# Altium project TX_Round1.PrjPcb
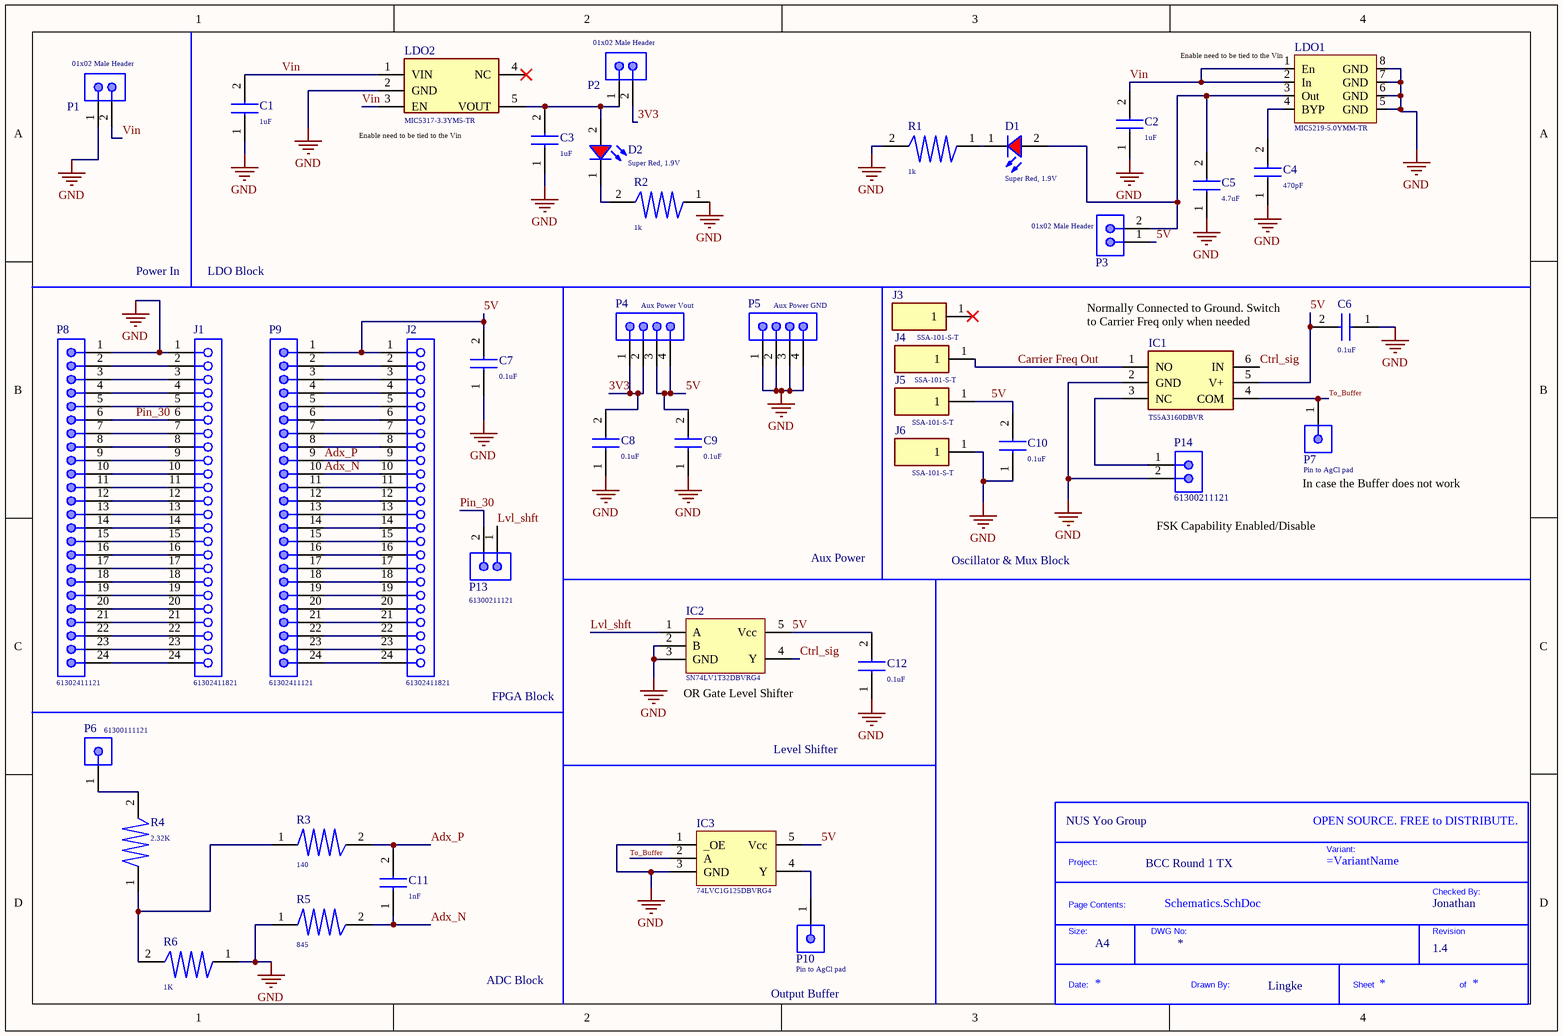
[diagram p0: Schematics.SchDoc]
1 sheet, 44 parts. Net scope: global (net labels, ports and power ports of the same name join across sheets).
Board file: Layout.PcbDoc

## Sheet Schematics.SchDoc
size A4

### Parts
*?  Project Name: BCC Round 1 TX  Company: NUS Yoo Group  Drawn By: Lingke  Revision: 1.4  Size: A4  Checked By: Jonathan  (hidden comment: Title_Block)  (no BOM)
C1  1uF  [0603]
C2  1uF  [0603]
C3  1uF  [0603]
C4  470pF  [0603]
C5  4.7uF  [0603]
C6  0.1uF  [0603]
C7  0.1uF  [0603]
C8  0.1uF  [0603]
C9  0.1uF  [0603]
C10  0.1uF  [0603]
C11  1nF  [0603]
C12  0.1uF  [0603]
D1  Super Red, 1.9V  [WL-SMCW_0603_H=0.7mm]
D2  Super Red, 1.9V  [WL-SMCW_0603_H=0.7mm]
IC1  TS5A3160DBVR  [SOT-23-6]
IC2  SN74LV1T32DBVRG4  [SOT-23-5]
IC3  74LVC1G125DBVRG4  [SOT-23-5]
J1  61302411821  [61302411821]
J2  61302411821  [61302411821]
J3  SSA-101-S-T  [SSA-101-S-X]
J4  SSA-101-S-T  [SSA-101-S-X]
J5  SSA-101-S-T  [SSA-101-S-X]
J6  SSA-101-S-T  [SSA-101-S-X]
LDO1  MIC5219-5.0YMM-TR  [MSOP-8_MS]
LDO2  MIC5317-3.3YM5-TR  [SOT-23-5]
P1  01x02 Male Header  [61300211121]
P2  01x02 Male Header  [61300211121]
P3  01x02 Male Header  [61300211121]
P4  Aux Power Vout  [61300411121]
P5  Aux Power GND  [61300411121]
P6  61300111121  [61300111121]
P7  Pin to AgCl pad  [61300111121]
P8  61302411121  [61302411121]
P9  61302411121  [61302411121]
P10  Pin to AgCl pad  [61300111121]
P13  61300211121  [61300211121]
P14  61300211121  [61300211121]
R1  1k  [0603]
R2  1k  [0603]
R3  140  [0603]
R4  2.32K  [0603]
R5  845  [0603]
R6  1K  [0603]

### Nets
GND: C1.1 C2.1 C3.1 C4.1 C5.1 C6.1 C7.1 C8.1 C9.1 C10.1 C12.1 IC1.2(GND) IC2.2(B) IC2.3(GND) IC3.1(_OE) IC3.3(GND) J1.1 J6.1 LDO1.5(GND) LDO1.6(GND) LDO1.7(GND) LDO1.8(GND) LDO2.2(GND) P1.1 P5.1 P5.2 P5.3 P5.4 P8.1 P14.2 R1.2 R2.1 R5.1 R6.1
3V3: C8.2 P2.2 P4.1 P4.2
5V: C6.2 C7.2 C9.2 C10.2 C12.2 IC1.5(V+) IC2.5(Vcc) IC3.5(Vcc) J2.1 J5.1 P3.1 P4.3 P4.4 P9.1
Adx_N: C11.1 J2.10 P9.10 R5.2
Adx_P: C11.2 J2.9 P9.9 R3.2
Carrier Freq Out: IC1.1(NO) J4.1
Ctrl_sig: IC1.6(IN) IC2.4(Y)
Lvl_shft: IC2.1(A) P13.1
Pin_30: J1.6 P8.6 P13.2
To_Buffer: IC1.4(COM) IC3.2(A) P7.1
Vin: C1.2 C2.2 LDO1.1(En) LDO1.2(In) LDO2.1(VIN) LDO2.3(EN) P1.2
NetC3_2: C3.2 D2.2(A) LDO2.5(VOUT) P2.1
NetC4_2: C4.2 LDO1.4(BYP)
NetC5_2: C5.2 D1.2(A) LDO1.3(Out) P3.2
NetD1_1: D1.1(K) R1.1
NetD2_1: D2.1(K) R2.2
NetIC1_3: IC1.3(NC) P14.1
NetIC3_4: IC3.4(Y) P10.1
NetJ1_2: J1.2 P8.2
NetJ1_3: J1.3 P8.3
NetJ1_4: J1.4 P8.4
NetJ1_5: J1.5 P8.5
NetJ1_7: J1.7 P8.7
NetJ1_8: J1.8 P8.8
NetJ1_9: J1.9 P8.9
NetJ1_10: J1.10 P8.10
NetJ1_11: J1.11 P8.11
NetJ1_12: J1.12 P8.12
NetJ1_13: J1.13 P8.13
NetJ1_14: J1.14 P8.14
NetJ1_15: J1.15 P8.15
NetJ1_16: J1.16 P8.16
NetJ1_17: J1.17 P8.17
NetJ1_18: J1.18 P8.18
NetJ1_19: J1.19 P8.19
NetJ1_20: J1.20 P8.20
NetJ1_21: J1.21 P8.21
NetJ1_22: J1.22 P8.22
NetJ1_23: J1.23 P8.23
NetJ1_24: J1.24 P8.24
NetJ2_2: J2.2 P9.2
NetJ2_3: J2.3 P9.3
NetJ2_4: J2.4 P9.4
NetJ2_5: J2.5 P9.5
NetJ2_6: J2.6 P9.6
NetJ2_7: J2.7 P9.7
NetJ2_8: J2.8 P9.8
NetJ2_11: J2.11 P9.11
NetJ2_12: J2.12 P9.12
NetJ2_13: J2.13 P9.13
NetJ2_14: J2.14 P9.14
NetJ2_15: J2.15 P9.15
NetJ2_16: J2.16 P9.16
NetJ2_17: J2.17 P9.17
NetJ2_18: J2.18 P9.18
NetJ2_19: J2.19 P9.19
NetJ2_20: J2.20 P9.20
NetJ2_21: J2.21 P9.21
NetJ2_22: J2.22 P9.22
NetJ2_23: J2.23 P9.23
NetJ2_24: J2.24 P9.24
NetP6_1: P6.1 R4.2
NetR3_1: R3.1 R4.1 R6.2

Not connected (* = marked no-connect by the designer): J3 1*; LDO2 4(NC)*

### Notes on the sheet
- (near LDO1) Enable need to be tied to the Vin
- (near LDO2) Enable need to be tied to the Vin
- Power In
- LDO Block
- Normally Connected to Ground. Switch to Carrier Freq only when needed
- (near P7) In case the Buffer does not work
- Aux Power
- Oscillator & Mux Block
- (near P14) FSK Capability Enabled/Disable
- FPGA Block
- (near IC2) OR Gate Level Shifter
- Level Shifter
- ADC Block
- Output Buffer
- (in symbol Title_Block) OPEN SOURCE. FREE to DISTRIBUTE.; Variant:; Project:; Checked By:; Page Contents:; Size:; DWG No:; Revision; Date:; Drawn By:; Sheet; of

### Library data of the parts
*? = Title_Block: Standard Title Block.; DWG No: *
C1-C12 = Capacitor
D1 D2 = 150060SS75000: WL-SMCW SMT Mono-color Chip LED Waterclear, size 0603, Super Red, 1.9V, 140deg; Chip Technology: AlInGaP; Dominant Wavelength typ.: 630nm; Luminous Intensity typ.: 60mcd; Peak Wavelength typ.: 645nm; Viewing Angle: 140deg; ComponentLink1Description: Manufacturer; ComponentLink1URL: http://www.we-online.de; ComponentLink2URL: https://www.we-online.com/catalog/datasheet/150060SS75000.pdf; ComponentLink2Description: Datasheet; Forward Voltage typ.: 1.9V; Emitting Color: Super Red; Mounting Technology: SMT; Operating Temperature: -40 to +85degC; Published Date: December 2019; Part Number: 150060SS75000; Packaging: Tape and Reel; Size: 0603; Publisher: Wurth Elektronik
IC1 = TS5A3160DBVR: Integrated Circuit; Manufacturer_Name: Texas Instruments; Datasheet Link: http://www.ti.com/lit/gpn/ts5a3160; Height: 1.45mm; Mouser2 Part Number: 595-TS5A3160DBVR; Mouser2 Price/Stock: https://www.mouser.com/Search/Refine.aspx?Keyword=595-TS5A3160DBVR; Manufacturer_Part_Number: TS5A3160DBVR
J1 J2 = 61302411821: WR-PHD Socket Header, THT, pitch 2.54mm, Single Row, Vertical, 24p; Manufacturer: Wurth Elektronik; Pin Number: 24; Rated Current: 3A; Working Voltage: 250VAC; Withstanding Voltage: 500VAC; Contact Resistance: 20mOhm; ComponentLink1Description: Manufacturer; ComponentLink1URL: http://www.we-online.de; ComponentLink2Description: Datasheet; ComponentLink2URL: https://www.we-online.com/catalog/datasheet/61302411821.pdf; Manufacturer Part Number: 61302411821; Published Date: May 2020; Pitch: 2.54mm; Operating Temperature: -40 to +125degC; Mounting Technology: THT; Packaging: Tray; Gender: Socket Header; Row Number: Single; Orientation: Vertical
J3-J6 = SSA-101-S-T: Connector; Manufacturer_Name: SAMTEC; Datasheet Link: http://suddendocs.samtec.com/prints/ssas-mkt.pdf; Manufacturer_Part_Number: SSA-101-S-T
LDO2 = MIC5317-3.3YM5-TR: Power Supply; Manufacturer_Name: Microchip; Datasheet Link: https://componentsearchengine.com//MIC5317-3.3YM5-TR.pdf; Height: 1mm; Mouser2 Part Number: 998-MIC5317-3.3YM5TR; Mouser2 Price/Stock: https://www.mouser.com/Search/Refine.aspx?Keyword=998-MIC5317-3.3YM5TR; Manufacturer_Part_Number: MIC5317-3.3YM5-TR
P1-P3 P13 P14 = 61300211121: WR-PHD Pin Header, THT, pitch 2.54mm, Single Row, Vertical, 2p; Manufacturer: Wurth Elektronik; Pin Number: 2; Rated Current: 3A; Working Voltage: 250VAC; Withstanding Voltage: 500VAC; Contact Resistance: 20mOhm; ComponentLink1Description: Manufacturer; ComponentLink1URL: http://www.we-online.de; ComponentLink2Description: Datasheet; ComponentLink2URL: https://www.we-online.com/catalog/datasheet/61300211121.pdf; Manufacturer Part Number: 61300211121; Published Date: May 2020; Pitch: 2.54mm; Operating Temperature: -40 to +105degC; Mounting Technology: THT; Packaging: Bag; Gender: Pin Header; Row Number: Single; Orientation: Vertical
P4 P5 = 61300411121: WR-PHD Pin Header, THT, pitch 2.54mm, Single Row, Vertical, 4p; Manufacturer: Wurth Elektronik; Pin Number: 4; Rated Current: 3A; Working Voltage: 250VAC; Withstanding Voltage: 500VAC; Contact Resistance: 20mOhm; ComponentLink1Description: Manufacturer; ComponentLink1URL: http://www.we-online.de; ComponentLink2Description: Datasheet; ComponentLink2URL: https://www.we-online.com/catalog/datasheet/61300411121.pdf; Manufacturer Part Number: 61300411121; Published Date: May 2020; Pitch: 2.54mm; Operating Temperature: -40 to +105degC; Mounting Technology: THT; Packaging: Bag; Gender: Pin Header; Row Number: Single; Orientation: Vertical
P6 P7 P10 = 61300111121: WR-PHD Pin Header, THT, pitch 2.54mm, Single Row, Vertical, 1p; Manufacturer: Wurth Elektronik; Pin Number: 1; Rated Current: 3A; Working Voltage: 250VAC; Withstanding Voltage: 500VAC; Contact Resistance: 20mOhm; ComponentLink1Description: Manufacturer; ComponentLink1URL: http://www.we-online.de; ComponentLink2Description: Datasheet; ComponentLink2URL: https://www.we-online.com/catalog/datasheet/61300111121.pdf; Manufacturer Part Number: 61300111121; Published Date: May 2020; Pitch: 2.54mm; Operating Temperature: -40 to +105degC; Mounting Technology: THT; Packaging: Bag; Gender: Pin Header; Row Number: Single; Orientation: Vertical
P8 P9 = 61302411121: WR-PHD Pin Header, THT, pitch 2.54mm, Single Row, Vertical, 24p; Manufacturer: Wurth Elektronik; Pin Number: 24; Rated Current: 3A; Working Voltage: 250VAC; Withstanding Voltage: 500VAC; Contact Resistance: 20mOhm; ComponentLink1Description: Manufacturer; ComponentLink1URL: http://www.we-online.de; ComponentLink2Description: Datasheet; ComponentLink2URL: https://www.we-online.com/catalog/datasheet/61302411121.pdf; Manufacturer Part Number: 61302411121; Published Date: May 2020; Pitch: 2.54mm; Operating Temperature: -40 to +105degC; Mounting Technology: THT; Packaging: Bag; Gender: Pin Header; Row Number: Single; Orientation: Vertical
R1-R6 = Resistor
IC2 = SN74LV1T32DBVRG4: Supplier 1: Mouser; Supplier Part Number 1: 595-SN74LV1T32DBVRG4
IC3 = 74LVC1G125DBVRG4: Supplier 1: Mouser; Supplier Part Number 1: 595-74LVC1G125DBVRG4